# EAGLE schematic outlines (EAGLE 7.5.0)
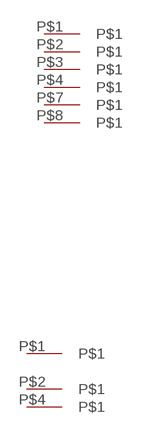
[diagram p0: schematic, sheet 1]

## Parts
U$1  MIDIBOX_HALF  [MIDIBOX14X6]
U$2  MIDIBOX_FULL  [MIDIBOX14X12]
Unconnected: U$1.P$1 U$1.P$2 U$1.P$4 U$2.P$1 U$2.P$2 U$2.P$3 U$2.P$4 U$2.P$7 U$2.P$8

## Library data of the parts
U$1 = Frames_VLR:MIDIBOX_HALF
U$2 = Frames_VLR:MIDIBOX_FULL